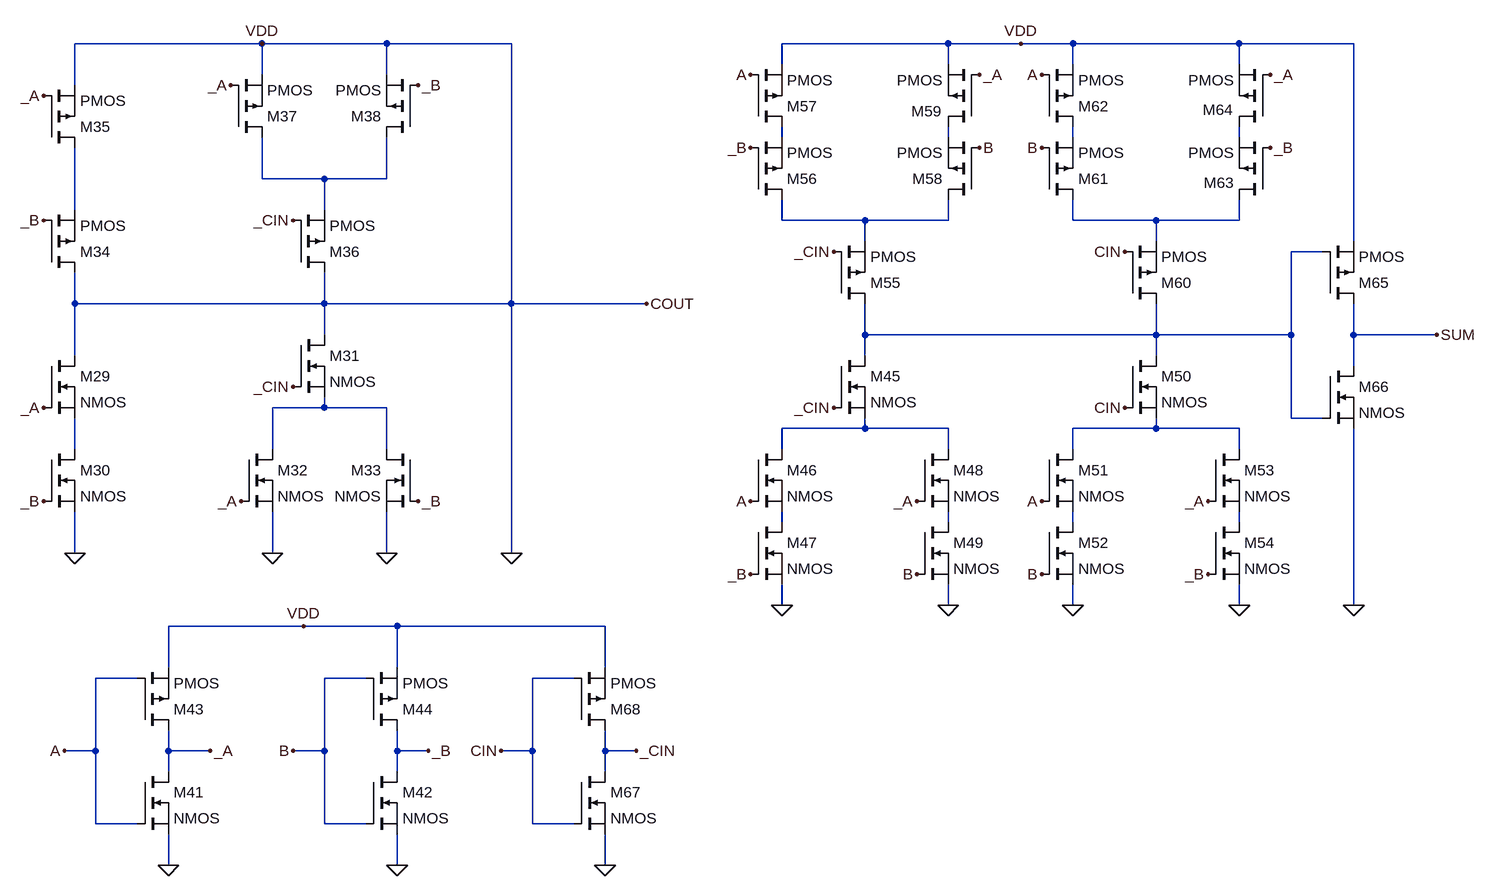
[diagram p0: schematic FA without inv.asc]
FA without inv.asc, the LTspice schematic file:
Version 4
SHEET 1 1280 680
WIRE -1344 -1168 -1632 -1168
WIRE -1152 -1168 -1344 -1168
WIRE -960 -1168 -1152 -1168
WIRE -288 -1168 -544 -1168
WIRE -176 -1168 -288 -1168
WIRE -96 -1168 -176 -1168
WIRE 160 -1168 -96 -1168
WIRE 336 -1168 160 -1168
WIRE -544 -1136 -544 -1168
WIRE -288 -1136 -288 -1168
WIRE -96 -1136 -96 -1168
WIRE 160 -1136 160 -1168
WIRE -1344 -1120 -1344 -1168
WIRE -1152 -1120 -1152 -1168
WIRE -1632 -1104 -1632 -1168
WIRE -544 -1024 -544 -1040
WIRE -288 -1024 -288 -1040
WIRE -96 -1024 -96 -1040
WIRE 160 -1024 160 -1040
WIRE -1344 -960 -1344 -1024
WIRE -1248 -960 -1344 -960
WIRE -1152 -960 -1152 -1024
WIRE -1152 -960 -1248 -960
WIRE -1632 -912 -1632 -1008
WIRE -1248 -912 -1248 -960
WIRE -544 -896 -544 -928
WIRE -416 -896 -544 -896
WIRE -288 -896 -288 -928
WIRE -288 -896 -416 -896
WIRE -96 -896 -96 -928
WIRE 32 -896 -96 -896
WIRE 160 -896 160 -928
WIRE 160 -896 32 -896
WIRE -416 -864 -416 -896
WIRE 32 -864 32 -896
WIRE 336 -864 336 -1168
WIRE 288 -848 240 -848
WIRE -1632 -768 -1632 -816
WIRE -1248 -768 -1248 -816
WIRE -1248 -768 -1632 -768
WIRE -960 -768 -960 -1168
WIRE -960 -768 -1248 -768
WIRE -752 -768 -960 -768
WIRE -1248 -720 -1248 -768
WIRE -416 -720 -416 -768
WIRE 32 -720 32 -768
WIRE 32 -720 -416 -720
WIRE 240 -720 240 -848
WIRE 240 -720 32 -720
WIRE 336 -720 336 -768
WIRE 464 -720 336 -720
WIRE -1632 -688 -1632 -768
WIRE -416 -688 -416 -720
WIRE 32 -688 32 -720
WIRE 336 -672 336 -720
WIRE -1248 -608 -1248 -624
WIRE -1248 -608 -1328 -608
WIRE -1152 -608 -1248 -608
WIRE 240 -592 240 -720
WIRE 288 -592 240 -592
WIRE -416 -576 -416 -592
WIRE -416 -576 -544 -576
WIRE -288 -576 -416 -576
WIRE 32 -576 32 -592
WIRE 32 -576 -96 -576
WIRE 160 -576 32 -576
WIRE -1632 -544 -1632 -592
WIRE -1328 -544 -1328 -608
WIRE -1152 -544 -1152 -608
WIRE -544 -544 -544 -576
WIRE -288 -544 -288 -576
WIRE -96 -544 -96 -576
WIRE 160 -544 160 -576
WIRE -544 -432 -544 -448
WIRE -288 -432 -288 -448
WIRE -96 -432 -96 -448
WIRE 160 -432 160 -448
WIRE -1632 -384 -1632 -448
WIRE -1328 -384 -1328 -448
WIRE -1152 -384 -1152 -448
WIRE -960 -384 -960 -768
WIRE -544 -304 -544 -336
WIRE -288 -304 -288 -336
WIRE -96 -304 -96 -336
WIRE 160 -304 160 -336
WIRE 336 -304 336 -576
WIRE -1280 -272 -1488 -272
WIRE -1136 -272 -1280 -272
WIRE -816 -272 -1136 -272
WIRE -1488 -208 -1488 -272
WIRE -1136 -208 -1136 -272
WIRE -816 -208 -816 -272
WIRE -1536 -192 -1600 -192
WIRE -1184 -192 -1248 -192
WIRE -864 -192 -928 -192
WIRE -1600 -80 -1600 -192
WIRE -1600 -80 -1648 -80
WIRE -1488 -80 -1488 -112
WIRE -1424 -80 -1488 -80
WIRE -1248 -80 -1248 -192
WIRE -1248 -80 -1296 -80
WIRE -1136 -80 -1136 -112
WIRE -1088 -80 -1136 -80
WIRE -928 -80 -928 -192
WIRE -928 -80 -976 -80
WIRE -816 -80 -816 -112
WIRE -768 -80 -816 -80
WIRE -1488 -48 -1488 -80
WIRE -1136 -48 -1136 -80
WIRE -816 -48 -816 -80
WIRE -1600 32 -1600 -80
WIRE -1536 32 -1600 32
WIRE -1248 32 -1248 -80
WIRE -1184 32 -1248 32
WIRE -928 32 -928 -80
WIRE -864 32 -928 32
WIRE -1488 96 -1488 48
WIRE -1136 96 -1136 48
WIRE -816 96 -816 48
FLAG -1632 -384 0
FLAG -1328 -384 0
FLAG -1152 -384 0
FLAG -1344 -1168 VDD
FLAG -960 -384 0
FLAG -752 -768 COUT
FLAG -1280 -272 VDD
FLAG -1488 96 0
FLAG -1136 96 0
FLAG -544 -304 0
FLAG -288 -304 0
FLAG -96 -304 0
FLAG 160 -304 0
FLAG 336 -304 0
FLAG 464 -720 SUM
FLAG -176 -1168 VDD
FLAG -816 96 0
FLAG -1680 -1088 _A
FLAG -1392 -1104 _A
FLAG -1680 -608 _A
FLAG -1376 -464 _A
FLAG -1648 -80 A
FLAG -592 -1120 A
FLAG -144 -1120 A
FLAG -592 -464 A
FLAG -144 -464 A
FLAG -1424 -80 _A
FLAG -240 -1120 _A
FLAG 208 -1120 _A
FLAG -336 -464 _A
FLAG 112 -464 _A
FLAG -1680 -896 _B
FLAG -1680 -464 _B
FLAG -1104 -1104 _B
FLAG -1104 -464 _B
FLAG -1296 -80 B
FLAG -240 -1008 B
FLAG -144 -1008 B
FLAG -144 -352 B
FLAG -336 -352 B
FLAG -1088 -80 _B
FLAG -592 -1008 _B
FLAG 208 -1008 _B
FLAG 112 -352 _B
FLAG -592 -352 _B
FLAG -976 -80 CIN
FLAG -1296 -896 _CIN
FLAG -1296 -640 _CIN
FLAG -16 -848 CIN
FLAG -16 -608 CIN
FLAG -768 -80 _CIN
FLAG -464 -848 _CIN
FLAG -464 -608 _CIN
SYMBOL nmos -1680 -688 R0
SYMATTR InstName M29
SYMBOL nmos -1680 -544 R0
SYMATTR InstName M30
SYMBOL nmos -1296 -720 R0
SYMATTR InstName M31
SYMBOL nmos -1376 -544 R0
SYMATTR InstName M32
SYMBOL nmos -1104 -544 M0
SYMATTR InstName M33
SYMBOL pmos -1680 -816 M180
SYMATTR InstName M34
SYMBOL pmos -1680 -1008 M180
SYMATTR InstName M35
SYMBOL pmos -1296 -816 M180
SYMATTR InstName M36
SYMBOL pmos -1392 -1024 M180
SYMATTR InstName M37
SYMBOL pmos -1104 -1024 R180
SYMATTR InstName M38
SYMBOL nmos -1536 -48 R0
SYMATTR InstName M41
SYMBOL nmos -1184 -48 R0
SYMATTR InstName M42
SYMBOL pmos -1536 -112 M180
SYMATTR InstName M43
SYMBOL pmos -1184 -112 M180
SYMATTR InstName M44
SYMBOL nmos -464 -688 R0
SYMATTR InstName M45
SYMBOL nmos -592 -544 R0
SYMATTR InstName M46
SYMBOL nmos -592 -432 R0
SYMATTR InstName M47
SYMBOL nmos -336 -544 R0
SYMATTR InstName M48
SYMBOL nmos -336 -432 R0
SYMATTR InstName M49
SYMBOL nmos -16 -688 R0
SYMATTR InstName M50
SYMBOL nmos -144 -544 R0
SYMATTR InstName M51
SYMBOL nmos -144 -432 R0
SYMATTR InstName M52
SYMBOL nmos 112 -544 R0
SYMATTR InstName M53
SYMBOL nmos 112 -432 R0
SYMATTR InstName M54
SYMBOL pmos -464 -768 M180
SYMATTR InstName M55
SYMBOL pmos -592 -928 M180
SYMATTR InstName M56
SYMBOL pmos -592 -1040 M180
SYMATTR InstName M57
SYMBOL pmos -240 -928 R180
SYMATTR InstName M58
SYMBOL pmos -240 -1040 R180
WINDOW 0 57 24 Left 2
SYMATTR InstName M59
SYMBOL pmos -16 -768 M180
SYMATTR InstName M60
SYMBOL pmos -144 -928 M180
SYMATTR InstName M61
SYMBOL pmos -144 -1040 M180
SYMATTR InstName M62
SYMBOL pmos 208 -928 R180
WINDOW 0 55 26 Left 2
SYMATTR InstName M63
SYMBOL pmos 208 -1040 R180
WINDOW 0 57 26 Left 2
SYMATTR InstName M64
SYMBOL pmos 288 -768 M180
SYMATTR InstName M65
SYMBOL nmos 288 -672 R0
SYMATTR InstName M66
SYMBOL nmos -864 -48 R0
SYMATTR InstName M67
SYMBOL pmos -864 -112 M180
SYMATTR InstName M68

The netlist it stands for:
* FA without inv.asc
M29 0 _A N013 N013 NMOS
M30 N013 _B 0 0 NMOS
M31 0 _CIN N010 N010 NMOS
M32 N010 _A 0 0 NMOS
M33 N010 _B 0 0 NMOS
M34 0 _B N006 N006 PMOS
M35 N006 _A 0 0 PMOS
M36 0 _CIN N005 N005 PMOS
M37 N005 _A 0 0 PMOS
M38 N005 _B 0 0 PMOS
M41 _A A 0 0 NMOS
M42 _B B 0 0 NMOS
M43 _A A 0 0 PMOS
M44 _B B 0 0 PMOS
M45 N009 _CIN N011 N011 NMOS
M46 N011 A N014 N014 NMOS
M47 N014 _B 0 0 NMOS
M48 N011 _A N015 N015 NMOS
M49 N015 B 0 0 NMOS
M50 N009 CIN N012 N012 NMOS
M51 N012 A N016 N016 NMOS
M52 N016 B 0 0 NMOS
M53 N012 _A N017 N017 NMOS
M54 N017 _B 0 0 NMOS
M55 N009 _CIN N007 N007 PMOS
M56 N007 _B N001 N001 PMOS
M57 N001 A 0 0 PMOS
M58 N007 B N002 N002 PMOS
M59 N002 _A 0 0 PMOS
M60 N009 CIN N008 N008 PMOS
M61 N008 B N003 N003 PMOS
M62 N003 A 0 0 PMOS
M63 N008 _B N004 N004 PMOS
M64 N004 _A 0 0 PMOS
M65 SUM N009 0 0 PMOS
M66 SUM N009 0 0 NMOS
M67 _CIN CIN 0 0 NMOS
M68 _CIN CIN 0 0 PMOS
.model NMOS NMOS
.model PMOS PMOS
.lib standard.mos
.backanno
.end